# Altium schematic sheet top.SchDoc
size A
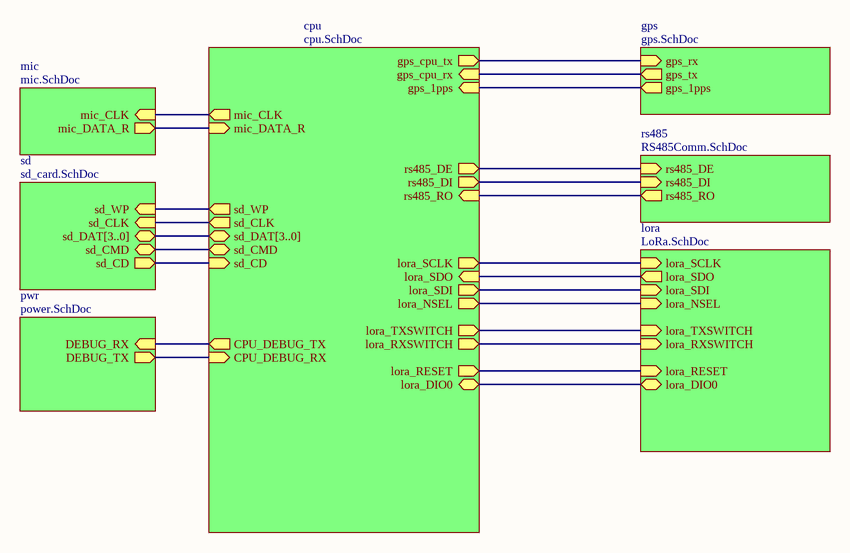
[diagram p0: top.SchDoc]

## Sub-sheets
cpu = cpu.SchDoc: gps_1pps (in), mic_CLK (out), mic_DATA_R (in), sd_WP (out), sd_CLK (out), sd_DAT[3..0] (bidir), sd_CMD (bidir), sd_CD (in), CPU_DEBUG_RX (in), CPU_DEBUG_TX (out), gps_cpu_tx (out), gps_cpu_rx (in), rs485_DI (out), rs485_RO (in), rs485_DE (out), lora_RXSWITCH (out), lora_SDI (out), lora_SCLK (out), lora_SDO (in), lora_NSEL (out), lora_RESET (out), lora_TXSWITCH (out), lora_DIO0 (bidir)
gps = gps.SchDoc: gps_rx (in), gps_tx (out), gps_1pps (out)
lora = LoRa.SchDoc: lora_SDO (out), lora_SCLK (in), lora_NSEL (in), lora_DIO0 (bidir), lora_SDI (in), lora_RESET (in), lora_RXSWITCH (in), lora_TXSWITCH (in)
mic = mic.SchDoc: mic_CLK (in), mic_DATA_R (out)
pwr = power.SchDoc: DEBUG_RX (in), DEBUG_TX (out)
rs485 = RS485Comm.SchDoc: rs485_DE (in), rs485_DI (in), rs485_RO (out)
sd = sd_card.SchDoc: sd_WP (in), sd_CD (out), sd_CMD (bidir), sd_CLK (in), sd_DAT[3..0] (bidir)

## Nets
(unnamed): sheet cpu/gps_1pps, sheet gps/gps_1pps
(unnamed): sheet cpu/mic_CLK, sheet mic/mic_CLK
(unnamed): sheet cpu/mic_DATA_R, sheet mic/mic_DATA_R
(unnamed): sheet cpu/sd_WP, sheet sd/sd_WP
(unnamed): sheet cpu/sd_CLK, sheet sd/sd_CLK
(unnamed): sheet cpu/sd_CMD, sheet sd/sd_CMD
(unnamed): sheet cpu/sd_CD, sheet sd/sd_CD
(unnamed): sheet cpu/CPU_DEBUG_RX, sheet pwr/DEBUG_TX
(unnamed): sheet cpu/CPU_DEBUG_TX, sheet pwr/DEBUG_RX
(unnamed): sheet cpu/gps_cpu_tx, sheet gps/gps_rx
(unnamed): sheet cpu/gps_cpu_rx, sheet gps/gps_tx
(unnamed): sheet cpu/rs485_DI, sheet rs485/rs485_DI
(unnamed): sheet cpu/rs485_RO, sheet rs485/rs485_RO
(unnamed): sheet cpu/rs485_DE, sheet rs485/rs485_DE
(unnamed): sheet cpu/lora_RXSWITCH, sheet lora/lora_RXSWITCH
(unnamed): sheet cpu/lora_SDI, sheet lora/lora_SDI
(unnamed): sheet cpu/lora_SCLK, sheet lora/lora_SCLK
(unnamed): sheet cpu/lora_SDO, sheet lora/lora_SDO
(unnamed): sheet cpu/lora_NSEL, sheet lora/lora_NSEL
(unnamed): sheet cpu/lora_RESET, sheet lora/lora_RESET
(unnamed): sheet cpu/lora_TXSWITCH, sheet lora/lora_TXSWITCH
(unnamed): sheet cpu/lora_DIO0, sheet lora/lora_DIO0

## Buses and harness runs
bus sheet cpu/sd_DAT[3..0] = sheet sd/sd_DAT[3..0]